# EAGLE design Square8 (EAGLE 6.4)
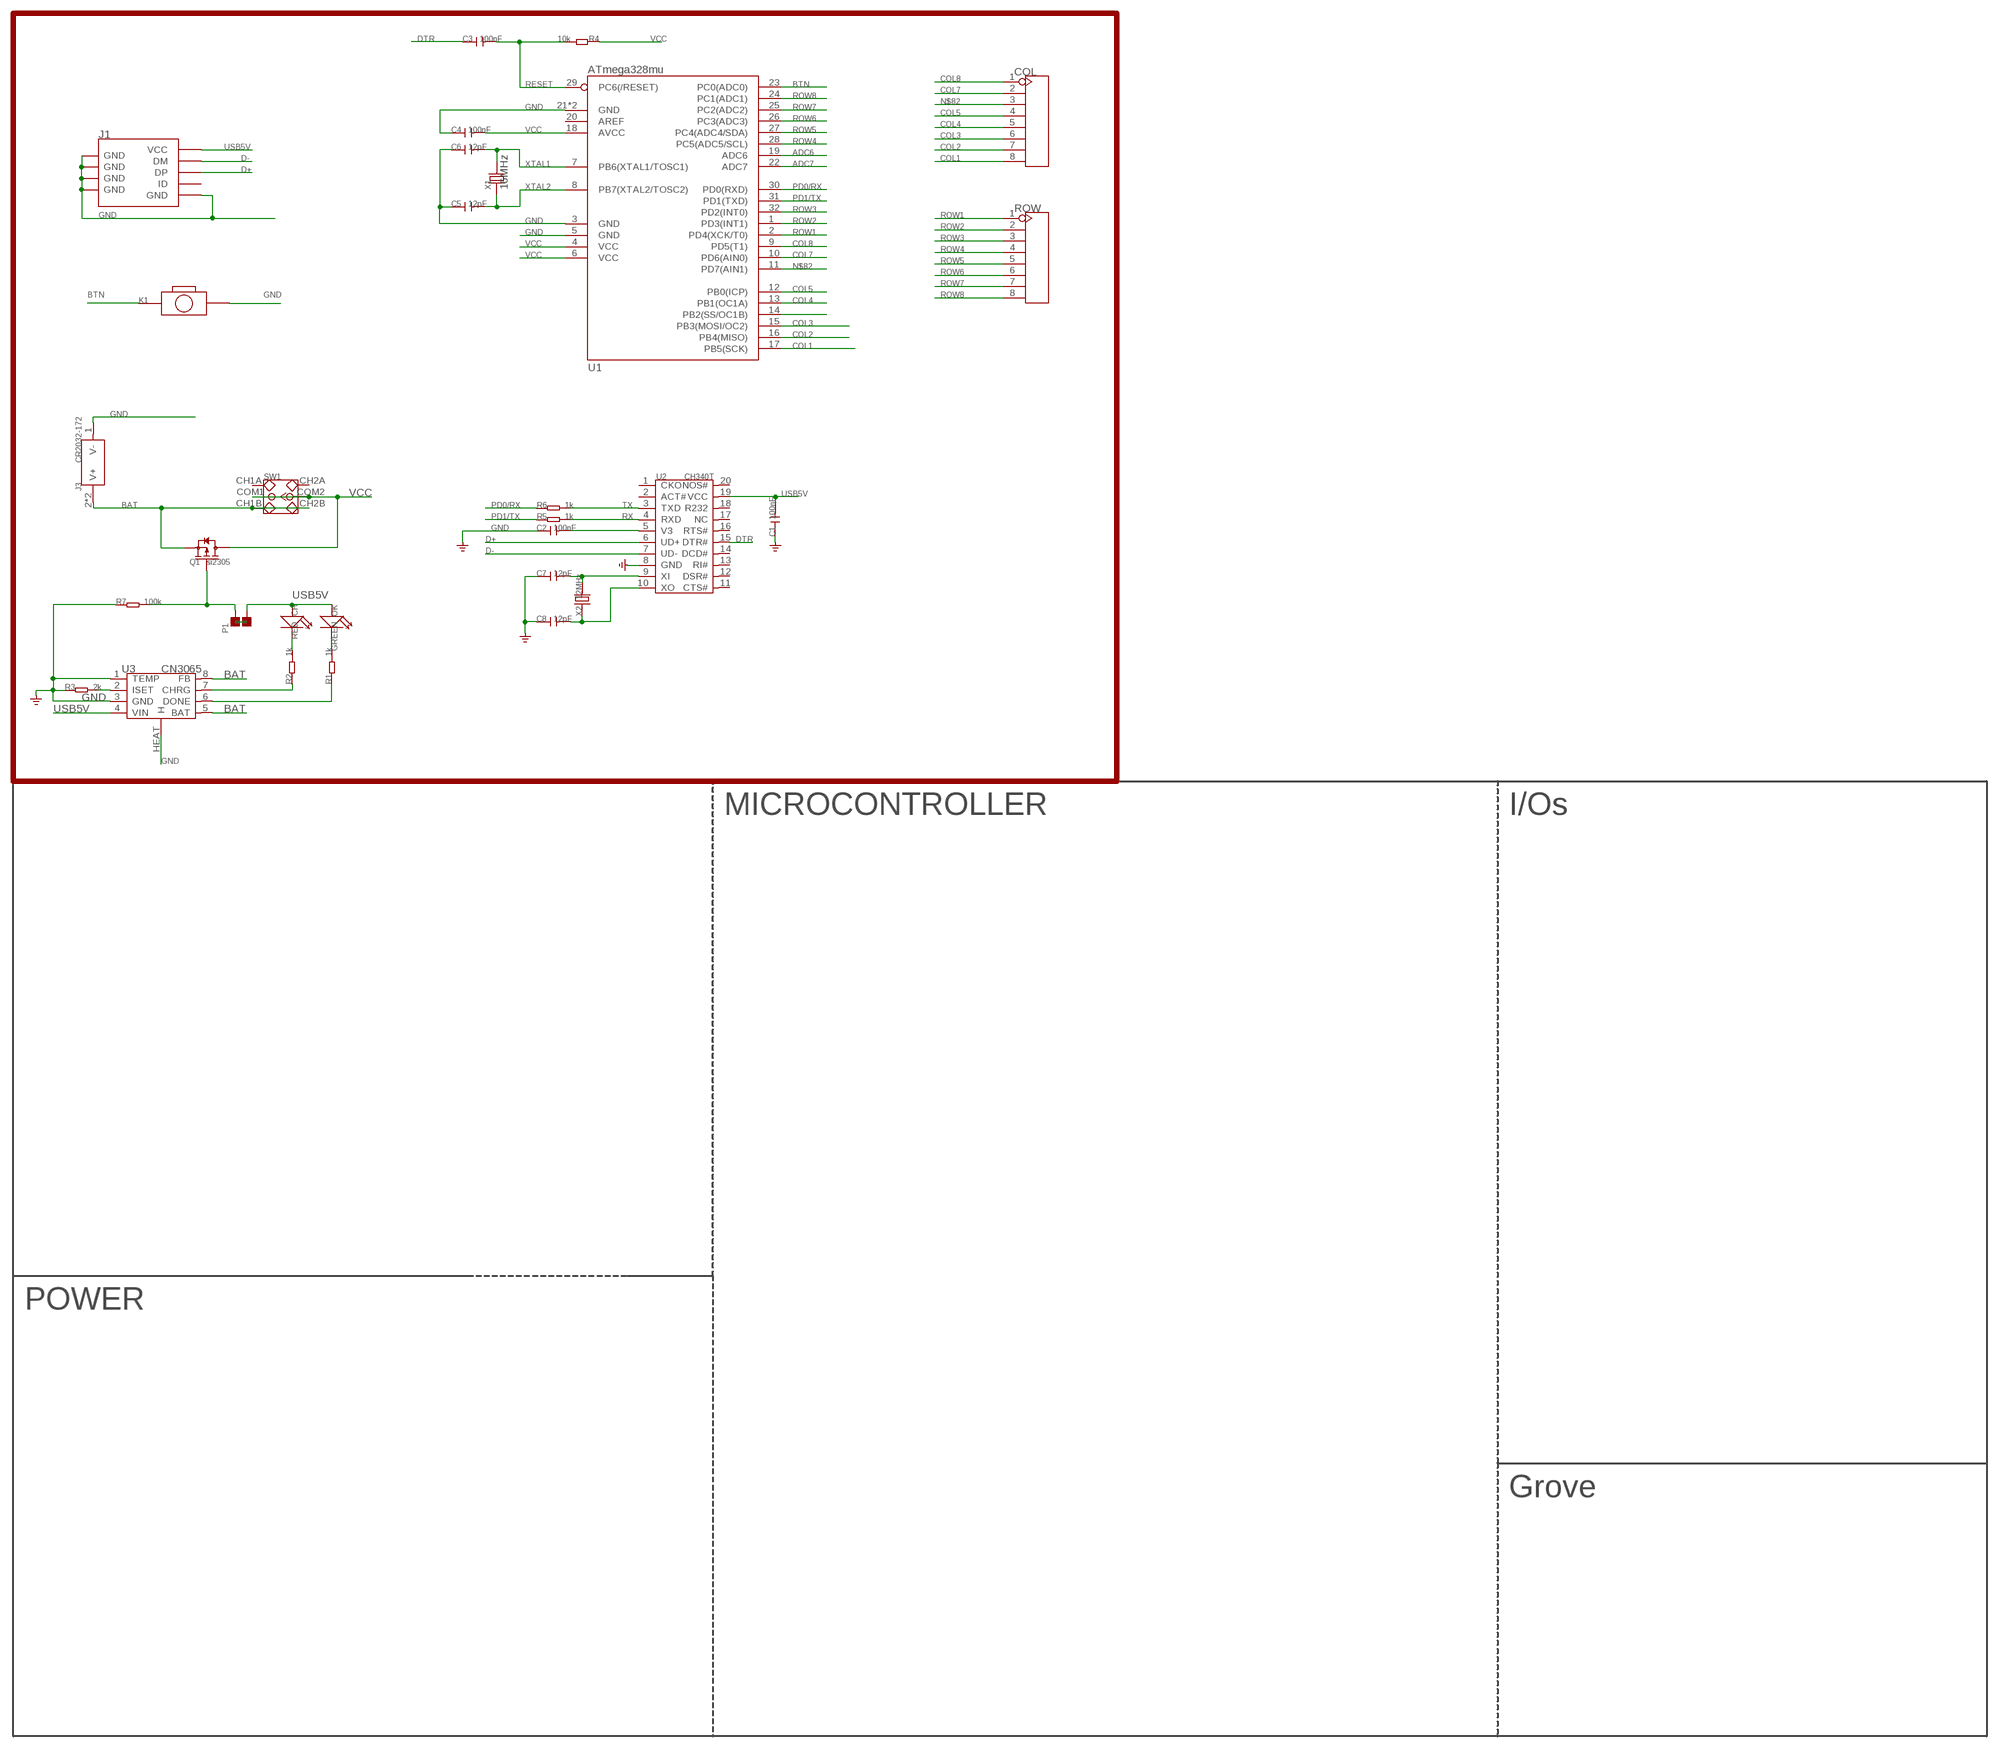
[diagram p0: schematic, sheet 1]

## Parts
C1  100nF  C'2.54'  [CERAMIC-2.54]
C2  100nF  C'2.54'  [CERAMIC-2.54]
C3  100nF  C'2.54'  [CERAMIC-2.54]
C4  100nF  C'2.54'  [CERAMIC-2.54]
C5  12pF  C-0603  [C0603]
C6  12pF  C-0603  [C0603]
C7  12pF  C-0603  [C0603]
C8  12pF  C-0603  [C0603]
CH  RED  LED-3MM  [LED-2P-2.54-3MM]
COL  HEADER-8P-2.54  [8P-2.54]
J1  USB-MINIUSB-5P-MICRO  [MICRO-USB]
J3  CR2032-172  HOLDER-BAT-CIRCLE  [2032-D20-CIRCLE]
K1  BUTTON-2P'TS-1101F'  [2P-3.4X6.0X3.55H-90D]
OK  GREEN  LED-3MM  [LED-2P-2.54-3MM]
P1  PAD-JUMPER-2P  [2P-SMD-1.78X1.27]
Q1  si2305  MOSFET-P'SI2323CDS/SI2305DS<BR>'  [SOT23]
R1  1k  R-0204/7  [R0204/7]
R2  1k  R-0204/7  [R0204/7]
R3  2k  R-0204/7  [R0204/7]
R4  10k  R-0204/7  [R0204/7]
R5  1k  R-0204/7  [R0204/7]
R6  1k  R-0204/7  [R0204/7]
R7  100k  R-0603  [R0603]
ROW  HEADER-8P-2.54  [8P-2.54]
SW1  SWITCH-2CH-6P'90D'  [6P-2CH-2.5-9.1X3.5X3.2H-90D]
U1  ATmega328mu  ATMEGA8/168/328MLF  [MLF32X-W/HEAT]
U2  CH340T  [SSOP20]
U3  CN3065  [DFN8]
X1  16MHz  CRYSTAL'HC49S'  [HC49S]
X2  12MHz  CRYSTAL'HC49S'  [HC49S]

## Nets
ADC6: U1.19(ADC6)
ADC7: U1.22(ADC7)
BAT: J3.2(V+) J3.3(V+) Q1.2(S) SW1.CH1B SW1.CH2B U3.5(BAT) U3.8(FB)
BTN: K1.P$1 U1.23(PC0(ADC0))
COL1: COL.8 U1.17(PB5(SCK))
COL2: COL.7 U1.16(PB4(MISO))
COL3: COL.6 U1.15(PB3(MOSI/OC2))
COL4: COL.5 U1.13(PB1(OC1A))
COL5: COL.4 U1.12(PB0(ICP))
COL7: COL.2 U1.10(PD6(AIN0))
COL8: COL.1 U1.9(PD5(T1))
D+: J1.3(DP) U2.6(UD+)
D-: J1.2(DM) U2.7(UD-)
DTR: C3.1 U2.15(DTR#)
GND [none1]: C1.1 C2.1 C4.1 C5.1 C6.1 C7.1 C8.1 J1.5(GND) J1.S1(GND) J1.S2(GND) J1.S3(GND) J1.S4(GND) J1.S5(GND) J1.S6(GND) J3.1(V-) K1.P$2 R3.1 R7.1 U1.3(GND) U1.5(GND) U1.21(GND) U1.HEAT(GND) U2.8(GND) U3.1(TEMP) U3.3(GND) U3.HEAT(H)
N$1: U1.14(PB2(SS/OC1B))
N$2: R2.1 U3.7(CHRG)
N$3: R1.1 U3.6(DONE)
N$4: OK.K(-) R1.2
N$5: CH.K(-) R2.2
N$7: R3.2 U3.2(ISET)
N$39: C7.2 U2.9(XI) X2.2
N$40: C8.2 U2.10(XO) X2.1
N$82: COL.3 U1.11(PD7(AIN1))
N$86: P1.2 Q1.1(G) R7.2
PD0/RX: R6.1 U1.30(PD0(RXD))
PD1/TX: R5.1 U1.31(PD1(TXD))
RESET: C3.2 R4.2 U1.29(PC6(/RESET))
ROW1: ROW.1 U1.2(PD4(XCK/T0))
ROW2: ROW.2 U1.1(PD3(INT1))
ROW3: ROW.3 U1.32(PD2(INT0))
ROW4: ROW.4 U1.28(PC5(ADC5/SCL))
ROW5: ROW.5 U1.27(PC4(ADC4/SDA))
ROW6: ROW.6 U1.26(PC3(ADC3))
ROW7: ROW.7 U1.25(PC2(ADC2))
ROW8: ROW.8 U1.24(PC1(ADC1))
RX: R5.2 U2.4(RXD)
TX: R6.2 U2.3(TXD)
USB5V: C1.2 CH.A(+) J1.1(VCC) OK.A(+) P1.1 U2.19(VCC) U3.4(VIN)
V3: C2.2 U2.5(V3)
VCC: C4.2 Q1.3(D) R4.1 SW1.COM1 SW1.COM2 U1.4(VCC) U1.6(VCC) U1.18(AVCC)
XTAL1: C6.2 U1.7(PB6(XTAL1/TOSC1)) X1.2
XTAL2: C5.2 U1.8(PB7(XTAL2/TOSC2)) X1.1
Unconnected: J1.4(ID) SW1.CH1A SW1.CH2A U1.20(AREF) U2.1(CKO) U2.2(ACT#) U2.11(CTS#) U2.12(DSR#) U2.13(RI#) U2.14(DCD#) U2.16(RTS#) U2.17(NC) U2.18(R232) U2.20(NOS#)

## Notes on the sheet
- MICROCONTROLLER | I/Os
- POWER
- Grove

## Library data of the parts
C1-C8 = Discrete:C*: Ceramic Capacitors
CH OK = Discrete:LED*
COL ROW = Connector :HEADER-8P
J1 = dwin:USB-MINIUSB-5P
J3 = dwin:HOLDER-BAT: button cell holder
K1 = Discrete:BUTTON-2P
P1 = Discrete:PAD-JUMPER-2P; PARTNO: DNP
Q1 = Discrete:MOSFET-P
R1-R7 = Discrete:R*
SW1 = Discrete:SWITCH-2CH-6P
U1 = IC:ATMEGA8/168/328: MICROCONTROLLER
U2 = template:CH340T
U3 = IC:CN3065
X1 X2 = Discrete:CRYSTAL*: CRYSTAL

## Net classes
0 default: width 0.152 mm, drill 0.305 mm, clearance 0.152 mm
3 usbvcc: width 0.203 mm, drill 0.305 mm, clearance 0.203 mm

## Board
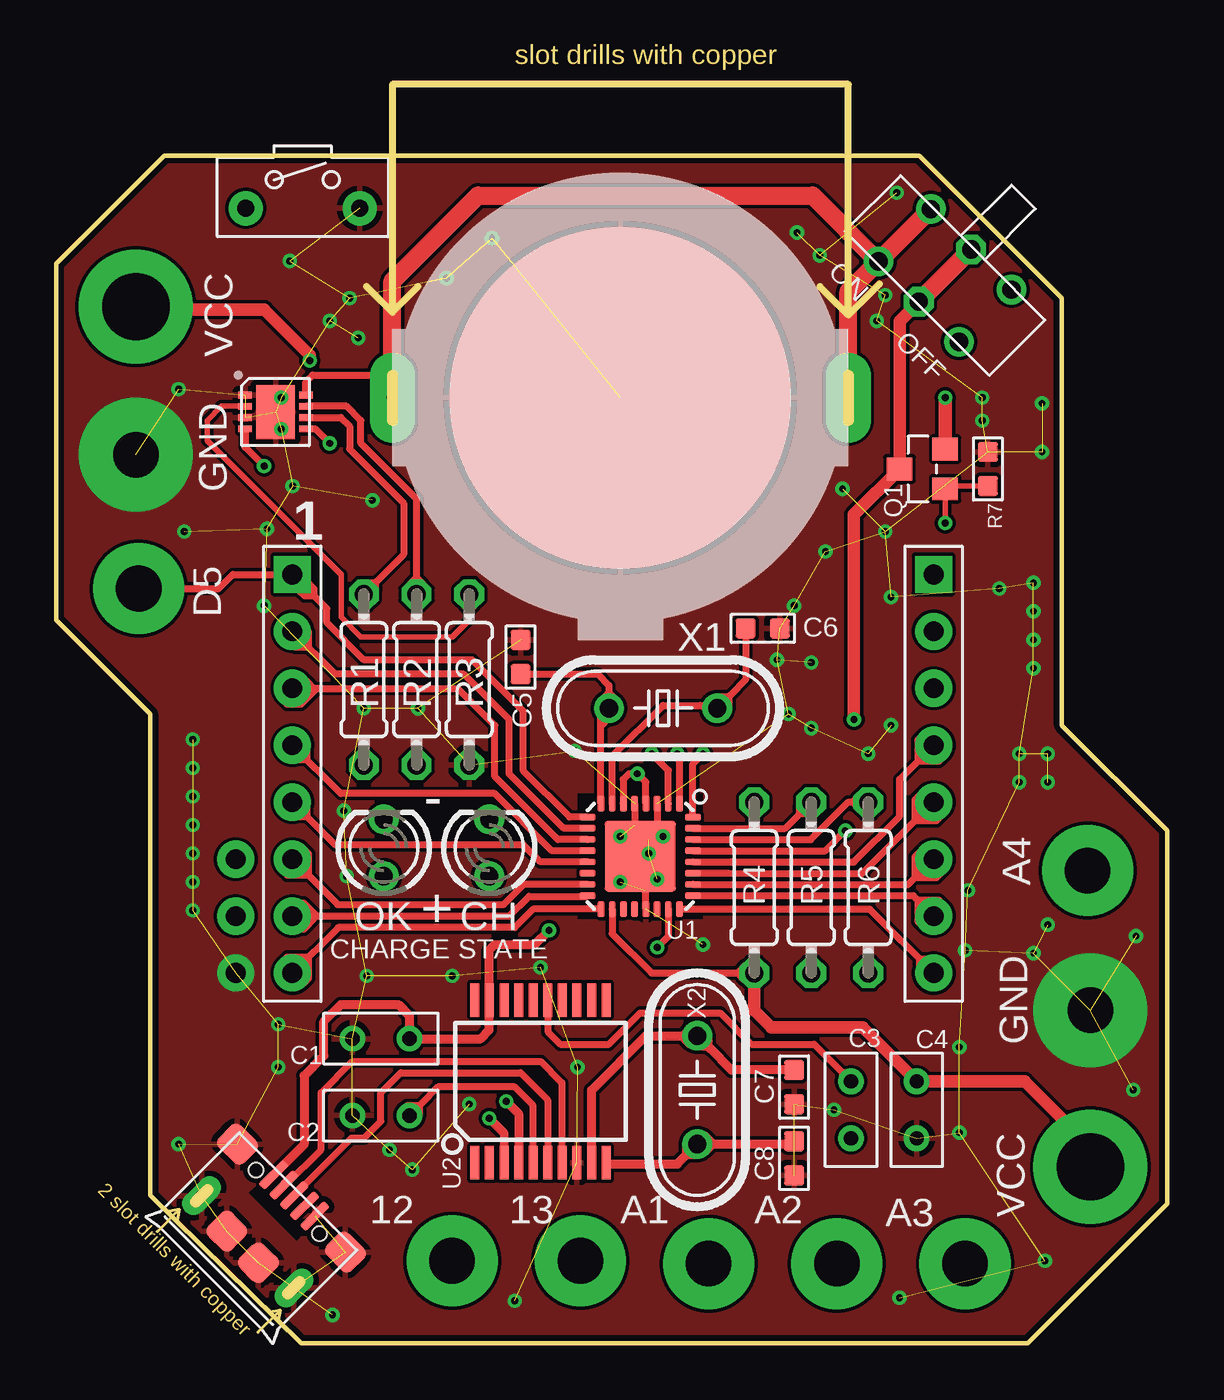
[diagram p1: board, top side]
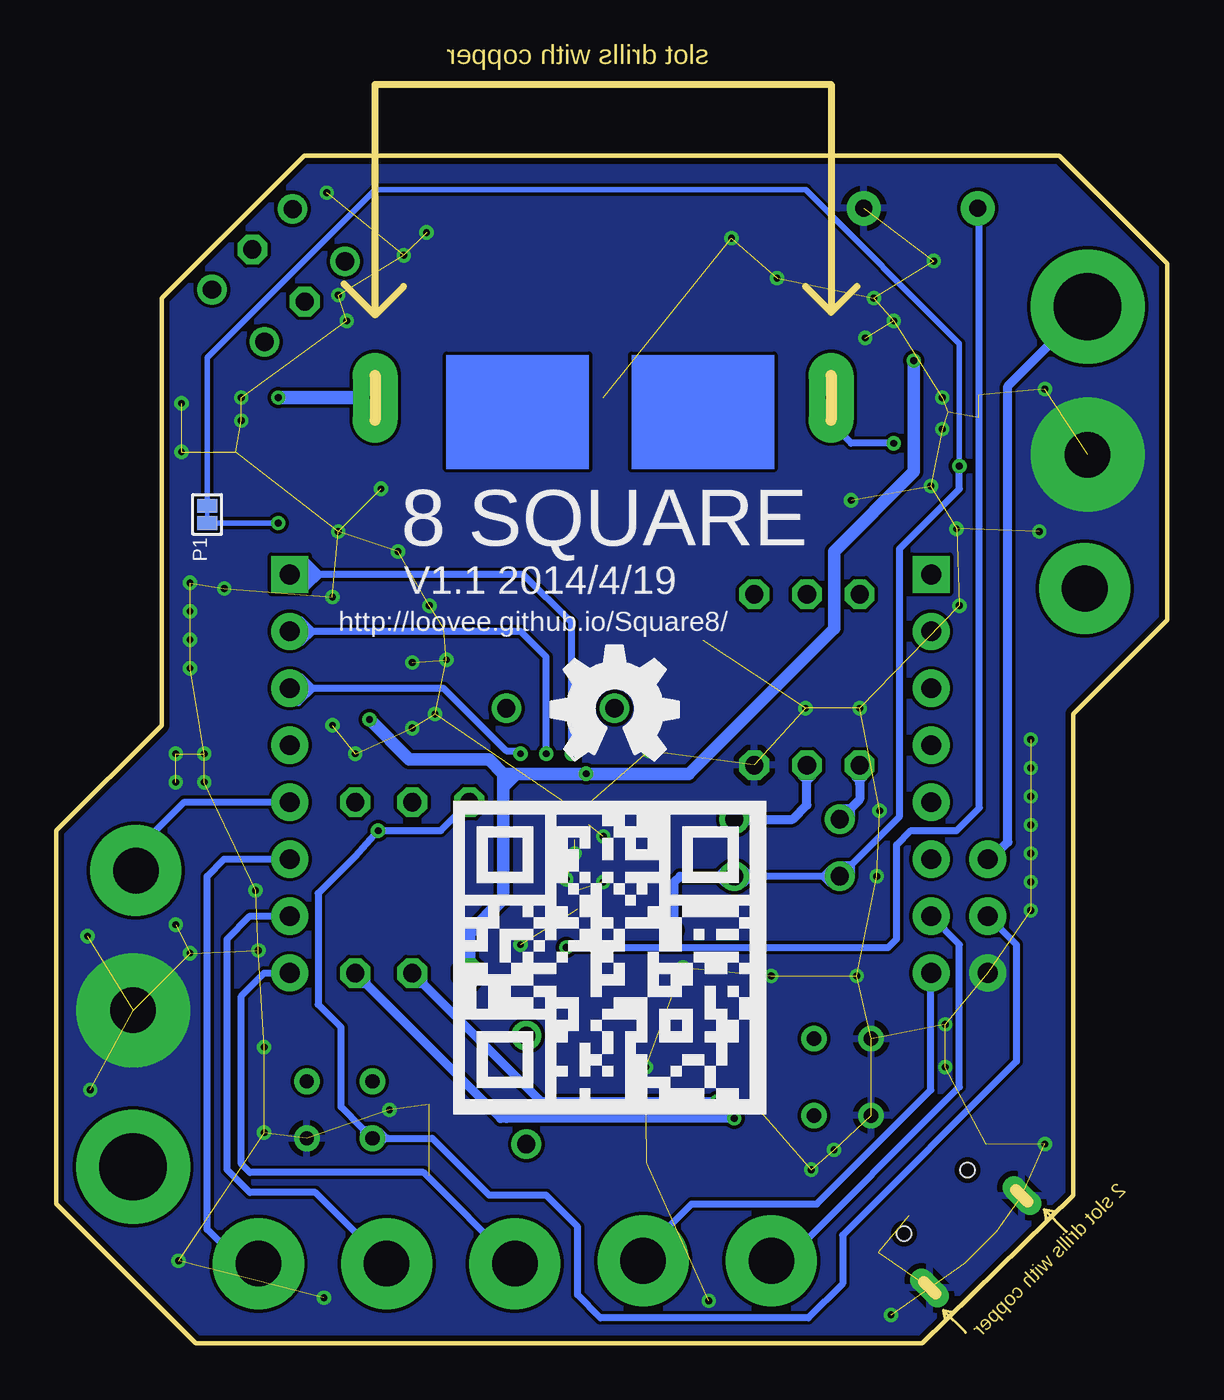
[diagram p2: board, bottom side, seen from below]

Size 49.53 x 52.96 mm. Coordinates in mm from the lower left corner, seen from the top.
Outline: 38.48,52.96 4.83,52.96 0,48.13 0,32.26 4.19,28.07 4.19,6.6 10.92,0 43.31,0 49.53,6.22 49.53,22.86 44.83,27.56 44.83,46.61 38.48,52.96
Copper layers (1*16): Top 0.035mm / dielectric 1.5mm / Bottom 0.035mm
Design rules "SeeedStudio_DRU_no_angle_20130527": minimum track width 6mil, minimum drill 12mil, track to track 6mil, track to pad 6mil, pad to pad 6mil, via to via 6mil, smd to smd 0mil, copper to edge 10mil, drill to drill 10mil, minimum pad ring 10mil, minimum via ring 6mil, stop-mask expansion 2mil, vias tented up to drill 25mil, thermal gap 10mil

### Footprints (pad centres in the part's own frame; a part is rotated, then mirrored left to right if it is on the bottom)
CERAMIC-2.54 = drill 0.635 pad 1.143: 1 -1.27,0; 2 1.27,0
C0603 = smd 0.889 x 0.889: 1 -0.762,0; 2 0.762,0
LED-2P-2.54-3MM = drill 0.813: A -1.27,0; K 1.27,0
8P-2.54 = drill 0.889 pad 1.651 square: 1 0,8.89 | drill 0.889 pad 1.651: 2 0,6.35; 3 0,3.81; 4 0,1.27; 5 0,-1.27; 6 0,-3.81; 7 0,-6.35; 8 0,-8.89
MICRO-USB = smd 0.381 x 1.524: 1 -1.3,-0.25; 2 -0.65,-0.25; 3 0,-0.25; 4 0.65,-0.25; 5 1.3,-0.25 | smd 1.6 x 1.397: S1 -3.4,-0.427; S6 3.4,-0.427 | drill 0.508 pad 1.016 long: S2 -2.908,-3.175; S5 2.908,-3.175 | smd 1.5 x 1.5: S3 -1,-3.5; S4 1,-3.5 | hole 0.635: -2,-0.65; 2,-0.65
2032-D20-CIRCLE = smd 15.24 x 15.24: 1 0,0 | drill 0.5 pad 2 long: 2 -10.16,0; 3 10.16,0
2P-3.4X6.0X3.55H-90D = drill 0.762 pad 1.524: P$1 0,2.54; P$2 0,-2.54
2P-SMD-1.78X1.27 = smd 0.889 x 0.61: 1 0,0.381; 2 0,-0.381
SOT23 = smd 1.016 x 1.143: 1 -0.889,-1.016; 2 0.889,-1.016; 3 0,1.016
R0204/7 = drill 0.813 octagon: 1 -3.81,0; 2 3.81,0
R0603 = smd 0.889 x 0.889: 1 -0.762,0; 2 0.762,0
6P-2CH-2.5-9.1X3.5X3.2H-90D = drill 0.813 pad 1.27: CH1A -2.54,-1.65; CH1B 2.54,-1.65; CH2A -2.54,1.65; CH2B 2.54,1.65 | drill 0.813 pad 1.27 octagon: COM1 0,-1.65; COM2 0,1.65
MLF32X-W/HEAT = smd 0.7 x 0.3: 1 -2.35,1.75; 2 -2.35,1.25; 3 -2.35,0.75; 4 -2.35,0.25; 5 -2.35,-0.25; 6 -2.35,-0.75; 7 -2.35,-1.25; 8 -2.35,-1.75; 17 2.35,-1.75; 18 2.35,-1.25; 19 2.35,-0.75; 20 2.35,-0.25; 21 2.35,0.25; 22 2.35,0.75; 23 2.35,1.25; 24 2.35,1.75 | smd 0.3 x 0.7: 9 -1.75,-2.35; 10 -1.25,-2.35; 11 -0.75,-2.35; 12 -0.25,-2.35; 13 0.25,-2.35; 14 0.75,-2.35; 15 1.25,-2.35; 16 1.75,-2.35; 25 1.75,2.35; 26 1.25,2.35; 27 0.75,2.35; 28 0.25,2.35; 29 -0.25,2.35; 30 -0.75,2.35; 31 -1.25,2.35; 32 -1.75,2.35 | smd 3.175 x 3.175: HEAT 0,0
SSOP20 = smd 0.4 x 1.5: 1 -2.925,-3.625; 2 -2.275,-3.625; 3 -1.625,-3.625; 4 -0.975,-3.625; 5 -0.325,-3.625; 6 0.325,-3.625; 7 0.975,-3.625; 8 1.625,-3.625; 9 2.275,-3.625; 10 2.925,-3.625; 11 2.925,3.625; 12 2.275,3.625; 13 1.625,3.625; 14 0.975,3.625; 15 0.325,3.625; 16 -0.325,3.625; 17 -0.975,3.625; 18 -1.625,3.625; 19 -2.275,3.625; 20 -2.925,3.625
DFN8 = smd 0.3 x 0.6: 1 -0.75,-1.35; 2 -0.25,-1.35; 3 0.25,-1.35; 4 0.75,-1.35; 5 0.75,1.35; 6 0.25,1.35; 7 -0.25,1.35; 8 -0.75,1.35 | smd 2.4 x 1.7: HEAT 0,0
HC49S = drill 0.813: 1 -2.413,0; 2 2.413,0

### Placement (x,y rotation side)
C1  14.48,13.59 0 top
C2  14.48,10.16 0 top
C3  35.43,10.41 270 top
C4  38.35,10.41 90 top
C5  20.7,30.61 270 top
C6  31.5,31.88 180 top
C7  32.89,11.43 90 top
C8  32.89,8.25 90 top
CH  19.3,22.1 90 top
COL  10.53,25.4 0 top
J1  10.79,6.78 315 top
J3  25.15,42.16 180 top
K1  10.99,50.61 90 top
OK  14.6,22.1 90 top
P1  42.8,36.96 0 bottom
Q1  38.61,38.99 90 top
R1  13.72,29.59 270 top
R2  16.07,29.59 270 top
R3  18.42,29.59 90 top
R4  31.11,20.32 90 top
R5  33.66,20.32 270 top
R6  36.2,20.32 270 top
R7  41.53,38.99 270 top
ROW  39.11,25.4 0 top
SW1  39.61,47.61 135 top
U1  26.04,21.72 270 top
U2  21.59,11.68 0 top
U3  9.78,41.53 270 top
U$1  [OSHW_FILLX200_NOTEXT]  27.47,26.02 0 bottom
X1  27.05,28.32 0 top
X2  28.57,11.3 90 top

### Tracks (layer width: path | path; a pad name or v marks a point on that pad's centre or on a via)
BAT  (via drill 0.3 pad 0.64)
  Top 0.305: U3.8 11.13,42.88 11.43,43.18 14.48,43.18 14.99,42.67 | U3.5 11.54,40.78 v12.19,40.13
  Top 0.406: 14.87,42.28 J3.3
  Top 0.61: Q1.2 v39.62,42.16
  Top 0.813: SW1.CH2B SW1.CH1B | J3.2 35.31,46.89 SW1.CH2B | J3.3 14.99,42.67 14.99,47.37 18.8,51.18 33.71,51.18 SW1.CH2B
  Bottom 0.305: v12.19,40.13 14.1,40.13 14.73,40.77 14.73,41.91 J3.3
  Bottom 0.61: v39.62,42.16 J3.2
BTN  (via drill 0.3 pad 0.64)
  Top 0.305: U1.23 27.29,18.14 v26.8,17.65
  Bottom 0.305: v26.8,17.65 12.45,17.65 12.06,18.03 12.06,22.22 11.43,22.86 9.4,22.86 8.38,23.88 8.38,50.54 K1.P$1
COL1  (via drill 2.03 pad 4.06)
  Top 0.305: U1.17 21.27,19.37 20.45,18.54 12.57,18.54 12.57,18.53 10.55,16.51 COL.8
  Bottom 0.305: v23.37,3.68 23.37,4.06 21.21,6.22 15.62,6.22 10.54,11.3 COL.8
COL2  (via drill 2.03 pad 4.06)
  Top 0.203: 23.66,19.94 U1.16 | 11.68,19.05 11.05,19.68 10.54,19.68
  Top 0.305: 23.66,19.94 21.08,19.94 20.19,19.05 11.68,19.05 11.43,19.05 | COL.7 11.43,19.05 | 11.18,19.3 11.43,19.05 | 11.43,19.05 11.05,18.67
  Bottom 0.305: v17.65,3.68 17.02,3.68 9.27,11.43 9.27,17.79 COL.7
COL3
  Top 0.305: U1.15 20.85,20.47 19.94,19.56 12.57,19.56 12.57,19.57 12.55,19.57 COL.6
COL4
  Top 0.305: U1.13 21.59,21.47 20.83,22.22 12.44,22.22 12.44,22.24 12.42,22.24 COL.5
COL5
  Top 0.305: U1.12 22.1,21.97 19.56,24.51 12.69,24.51 12.69,24.52 12.68,24.52 COL.4
COL7
  Top 0.305: U1.10 22.63,22.97 20.19,25.4 20.19,27.81 18.16,29.84 12.44,29.84 12.44,29.86 12.42,29.86 COL.2
COL8  (via drill 2.03 pad 4.06)
  Top 0.305: U1.9 22.89,23.47 20.83,25.53 20.83,28.19 18.54,30.48 13.72,30.48 12.06,32.13 12.06,32.76 COL.1 7.87,34.29 7.24,33.66 v3.68,33.66
D+
  Top 0.203: 21.97,8.11 U2.6
  Top 0.305: J1.3 13.15,9.14 13.72,9.14 14.48,9.91 14.48,11.18 15.37,12.07 20.7,12.07 21.91,10.86 U2.6
D-
  Top 0.203: 22.48,8.14 U2.7 | J1.2 10.23,7.06
  Top 0.305: 10.23,7.06 11.81,8.64 11.81,11.18 13.21,12.57 21.59,12.57 22.54,11.62 22.54,8.08 U2.7
DTR
  Top 0.305: U2.15 21.92,13.9 22.48,13.33 24.64,13.33 26.04,14.73 29.59,14.73 30.99,13.33 33.78,13.33 C3.1
GND  (via drill 0.3 pad 0.64, 0.89 pad 1.65, 2.03 pad 5.08)  (108 unrouted)
  Top 0.305: v26.42,21.84 26.16,21.84 U1.HEAT | U1.21 26.29,20.19 v26.8,20.7 | U1.3 26.79,22.87 v27.05,22.61 26.92,22.48 26.42,22.48 25.79,23.11 U1.5
  other vias: 46.1,14.86 3.56,39.62 37.21,33.27 37.21,27.56 10.03,42.16 10.03,40.77 8,16.51 42.93,26.29 25.15,22.61 25.15,20.57 23.11,26.42 13.72,28.32 16.13,28.32 42.93,25.02 44.2,25.02 44.2,26.29 43.94,41.91 43.94,39.75 42.04,33.66 41.27,42.16 28.83,17.78 12.83,23.75 37.46,51.31 6.1,26.92 6.1,25.65 6.1,24.38 6.1,23.11 6.1,21.84 6.1,20.57 6.1,19.3 32.13,30.48 33.66,30.35 32.89,32.89 32.64,28.07 33.66,27.43 21.59,16.76 23.24,12.32 14.86,8.64 18.42,10.67 40.64,20.19 44.2,18.67 40.51,17.53 43.56,17.4 13.46,44.83 13.08,46.61 12.19,45.59 10.41,48.26 10.54,38.23 37.59,2.03 20.45,1.9 12.32,1.27 5.46,8.89 13.84,16.38 17.65,16.38 36.2,26.29 9.27,32.89 44.07,3.68 48.01,11.3 48.13,18.16 43.56,33.91 43.56,32.64 43.56,31.37 43.56,30.1 35.05,38.1 34.29,35.31 15.87,7.75 9.91,14.22 9.91,12.32 12.95,20.83 36.96,36.19 41.27,41.15 36.58,45.59 36.96,46.74 33.02,49.53 34.04,48.51 19.43,49.28 17.4,47.5 14.1,37.59 9.4,36.32 5.46,42.55 5.71,36.19 40.26,13.21 40.26,9.4 34.67,10.41
  pour Top: -5.21,56.52 54.86,56.9 55.12,-4.19 -4.57,-2.79
  pour Bottom: -5.21,56.52 -4.57,-2.79 55.24,-4.06 54.74,56.9
N$2
  Top 0.305: R2.1 16.07,37.66 13.59,40.13 13.59,41.15 12.95,41.78 U3.7
N$3
  Top 0.203: 13.78,33.97 14.29,33.97 14.29,33.59
  Top 0.305: U3.6 12.7,41.28 13.08,40.89 13.08,39.88 15.49,37.47 15.49,35.18 14.29,33.97 R1.1
N$4
  Bottom 0.203: 13.97,25.34 13.97,25.21 13.72,24.96 13.46,25.21 13.46,25.34 | 14.03,23.43 14.03,23.94 14.54,23.94
  Bottom 0.406: R1.2 13.72,24.96 13.72,24.26 14.03,23.94 OK.K
N$5
  Bottom 0.203: 18.42,23.37 18.54,23.37 18.92,22.99
  Bottom 0.406: CH.K 18.42,23.37 16.7,23.37 16.07,24 R2.2
N$6
  Top 0.203: 10.54,31.11 10.67,30.99 11.3,30.99 11.3,31.75 11.05,32
N$7
  Top 0.203: 18.67,32.89 18.67,32.83 18.42,32.58 18.16,32.83 18.16,32.96
  Top 0.254: R3.2 18.42,32.58 18.42,32.26 17.65,31.5 13.59,31.5 12.7,32.39 12.7,34.29 6.73,40.26 6.73,41.15 7.37,41.78 U3.2
N$8
  Top 0.203: 11.24,26.61 11.24,25.91
N$11
  Top 0.203: 10.92,33.53 11.05,33.53 11.3,33.27 | 11.3,33.91 11.3,33.78 11.56,33.53 | 11.56,33.53 11.56,33.27 11.3,33.27 | 11.56,33.53 11.56,33.66 11.05,34.16 | 11.3,33.27 11.05,33.27 10.79,33.53
N$12
  Top 0.305: 10.67,26.04 11.18,26.04
N$38
  Top 0.305: 11.18,24 11.18,23.5 10.67,23.5
N$39
  Top 0.203: 28.51,13.14 29.15,13.14
  Top 0.406: C7.2 30.1,12.19 29.15,13.14 X2.2 26.29,13.72 23.87,11.29 U2.9
N$40
  Top 0.203: 24.57,8 U2.10 | 28.96,9.33 29.4,8.89 29.02,8.51
  Top 0.406: 24.57,8 27.69,8 X2.1 29.4,8.89 32.77,8.89 C8.2
N$67
  Top 0.305: 11.18,21.46 11.18,20.96 10.67,20.96
N$68
  Top 0.305: 11.18,16.64 11.18,17.14 10.54,17.14
N$70
  Top 0.305: 38.48,26.67 38.48,26.04 38.99,26.04
N$71
  Top 0.305: 38.48,24.13 38.48,23.5 39.12,23.5
N$72
  Top 0.305: 38.48,21.46 38.48,20.96 38.99,20.96
N$73
  Top 0.305: 38.48,19.3 38.48,19.68 38.99,19.68
N$74
  Top 0.305: 38.86,17.14 38.48,17.14 38.48,16.51
N$75
  Top 0.203: 38.35,26.04 38.35,26.92 38.61,27.18
N$76
  Top 0.203: 38.35,25.91 39.37,25.91 39.5,26.04
N$77
  Top 0.203: 38.73,24.76 38.23,24.26 38.23,23.24 39.24,23.24 39.62,23.62
N$78
  Top 0.203: 38.23,20.83 38.23,21.72 38.61,22.1
N$79
  Top 0.203: 38.23,20.7 39.24,20.7 39.62,21.08
N$80
  Top 0.203: 38.35,19.81 38.35,18.8 38.61,18.54
N$81
  Top 0.203: 38.48,19.81 39.37,19.81 39.62,19.56
N$82
  Top 0.203: 11.68,29.21 10.92,28.45 10.29,28.45 10.03,28.7 | 11.18,28.83 11.56,29.21 11.18,29.59
  Top 0.305: U1.11 22.36,22.47 19.56,25.27 19.56,27.56 17.91,29.21 11.68,29.21 11.56,29.21 COL.3
N$83
  Top 0.203: 10.92,22.22 11.3,21.84 11.3,20.83 10.29,20.83 10.16,20.96
N$84
  Top 0.203: 11.56,18.92 11.05,18.41 10.54,18.41
N$85
  Top 0.203: 10.03,17.02 10.29,17.27 11.3,17.27 11.3,16.26 11.05,16
N$86  (via drill 0.3 pad 0.64)
  Top 0.254: R7.2 39.75,38.23 Q1.1 v39.62,36.58
  Bottom 0.254: P1.2 v39.62,36.58
N$87
  Bottom 0.203: 42.8,36.7 42.8,37.21
N$88
  Top 0.203: 33.08,23.62 33.08,23.94
N$89
  Top 0.203: 33.15,23.56 33.59,23.56
N$90
  Bottom 0.203: 31.69,23.5 31.69,23.94 31.62,24
N$91
  Bottom 0.203: 31.75,23.56 31.31,23.56
N$92
  Bottom 0.203: 35.62,16.45 35.62,16
N$93
  Bottom 0.203: 36.26,15.94 35.69,15.94
N$94
  Bottom 0.203: 33.08,16.38 33.08,16
N$95
  Bottom 0.203: 33.59,15.94 33.15,15.94
N$96
  Bottom 0.203: 34.8,9.21 35.11,9.52
N$97
  Bottom 0.203: 35.88,9.21 35.88,9.65
N$98
  Top 0.203: 28,8.95 28,8.38
N$99
  Top 0.203: 28.57,8.32 28.07,8.32
N$100
  Top 0.203: 27.69,13.78 27.88,13.78 28.26,14.16
N$101
  Top 0.203: 28.26,13.27 28.19,13.27 27.81,13.65
N$102
  Top 0.203: 29.15,13.72 29.15,13.08
N$103
  Top 0.203: 30.67,16.89 30.35,16.57
N$104
  Top 0.203: 30.67,16.19 30.61,16.19 30.35,16.45
N$105
  Top 0.203: 15.75,33.84 15.75,33.91 16,34.16
N$106
  Top 0.203: 16.38,33.91 16.13,34.16
N$107
  Bottom 0.203: 14.99,21.21 15.05,21.21 15.37,20.89
N$108
  Bottom 0.203: 15.05,20.45 15.37,20.76
N$109
  Bottom 0.203: 14.03,20.83 14.03,21.34
N$110
  Bottom 0.203: 20.32,20.76 20.07,20.76 19.75,20.45
N$111
  Bottom 0.203: 16.38,25.4 16.38,25.27 16,24.89
N$112
  Bottom 0.203: 15.75,25.4 15.75,25.27 16,25.02
N$113
  Bottom 0.203: 18.42,23.5 18.67,23.5 18.92,23.75
N$114
  Top 0.203: 24.38,27.56 24.64,27.81
N$115
  Top 0.203: 34.99,11.75 34.99,12.19
N$116
  Top 0.203: 34.92,12.13 35.43,12.13
PD0/RX
  Top 0.203: 35.81,24.51 35.43,24.13 35.69,23.88
  Top 0.305: U1.30 33.64,22.47 35.31,24.13 35.43,24.13 R6.1
PD1/TX
  Top 0.305: U1.31 32.49,22.97 R5.1
RESET  (via drill 0.3 pad 0.64, 0.89 pad 1.65)
  Top 0.305: U1.29 34.29,21.97 v35.18,22.86
  Bottom 0.203: 34.73,9.14 34.8,9.14 35.11,8.83 | 35.43,9.59 35.88,9.59
  Bottom 0.305: v8,19.05 6.73,17.78 6.73,12.57 14.48,4.83 14.48,2.67 16,1.14 25.27,1.14 26.29,2.16 26.29,5.21 27.69,6.6 30.23,6.6 32.77,9.14 34.73,9.14 C3.2 35.88,9.59 36.83,10.54 36.83,14.1 37.85,15.11 37.85,20.07 36.2,21.72 v35.18,22.86 32.38,22.86 R4.2
ROW1  (via drill 0.3 pad 0.64)
  Top 0.305: U1.2 27.29,25.55 v26.54,26.29
  Bottom 0.203: 38.35,34.92 37.72,34.29 38.35,33.66
  Bottom 0.305: 37.97,34.29 37.72,34.29 28.7,34.29 26.54,32.13 v26.54,26.29 | 37.97,34.29 ROW.1 | 37.97,34.29 38.48,34.8 | 37.97,34.29 38.48,33.78
ROW2  (via drill 0.3 pad 0.64)
  Top 0.305: U1.1 27.79,26.19 v27.69,26.29
  Bottom 0.305: 38.1,31.75 28.83,31.75 27.69,30.61 v27.69,26.29 | 38.1,31.75 ROW.2 | 38.1,31.75 38.61,32.26 | 38.1,31.75 38.61,31.24
ROW3  (via drill 0.3 pad 0.64)
  Top 0.305: U1.32 28.39,25.84 v28.83,26.29
  Bottom 0.305: 38.1,29.21 32.26,29.21 29.46,26.42 28.96,26.42 v28.83,26.29 | 38.1,29.21 ROW.3 | 38.1,29.21 38.61,29.72 | 38.1,29.21 38.73,28.57
ROW4
  Top 0.305: U1.28 30.1,21.47 31.11,21.46 35.56,21.46 37.59,23.5 37.59,25.15 ROW.4
ROW5  (via drill 2.03 pad 4.06)
  Top 0.305: U1.27 29.96,20.97 30.99,20.96 35.95,20.96 35.95,20.97 ROW.5
  Bottom 0.305: v45.97,21.08 45.97,21.97 43.81,24.13 ROW.5
ROW6  (via drill 2.03 pad 4.06)
  Top 0.305: U1.26 38,20.47 38,20.48 ROW.6
  Bottom 0.305: v40.51,3.56 41.27,3.56 42.8,5.08 42.8,20.83 42.04,21.59 ROW.6
ROW7  (via drill 2.03 pad 4.06)
  Top 0.305: U1.25 38.21,19.97 38.21,19.95 ROW.7
  Bottom 0.305: ROW.7 40.89,19.05 41.91,18.03 41.91,7.75 40.89,6.73 37.97,6.73 v34.8,3.56
ROW8  (via drill 2.03 pad 4.06)
  Top 0.305: U1.24 36.27,19.37 36.27,19.35 ROW.8
  Bottom 0.305: v29.08,3.56 33.15,7.62 40.89,7.62 41.27,8 41.27,15.49 40.26,16.51 ROW.8
RX  (via drill 0.3 pad 0.64)
  Top 0.406: v20.07,10.79 20.62,10.25 U2.4
  Bottom 0.381: 28.07,10.92 R5.2
  Bottom 0.406: 28.07,10.92 27.94,10.79 v20.07,10.79
TX  (via drill 0.3 pad 0.64)
  Top 0.381: U2.3 19.96,9.37 v19.3,10.03
  Bottom 0.406: v19.3,10.03 29.46,10.03 29.72,10.03 R6.2
USB5V  (via drill 0.3 pad 0.64)
  Top 0.203: U2.19
  Top 0.305: U3.4 8.43,39.96 v9.27,39.12
  Top 0.406: U2.19 19.3,13.97 18.92,13.59 C1.2 15.75,14.61 15.24,15.11 12.7,15.11 11.94,14.35 11.94,12.83 11.05,11.94 11.05,8.88 J1.1 | U2.19 19.32,17.54 19.56,17.78 21.34,17.78 v21.97,18.41
  Bottom 0.203: 14.54,21.4 14.03,21.4 | 18.86,21.21 18.48,20.83 18.86,20.45 18.92,20.45 | 20.13,20.83 19.75,21.21
  Bottom 0.254: P1.1 42.8,43.94 35.31,51.44 16.13,51.44 9.27,44.58 v9.27,39.12
  Bottom 0.305: v9.27,39.12 9.27,38.1 11.94,35.43 11.94,23.5 14.03,21.4 OK.A 18.48,20.83 CH.A
  Bottom 0.406: v21.97,18.41 21.97,20.57 21.72,20.83 20.13,20.83 CH.A
V3
  Top 0.203: 16.26,10.16 16.26,10.67 15.62,10.67
  Top 0.305: U2.5 21.27,10.61 20.45,11.43 17.02,11.43 16.26,10.67 C2.2
VCC  (via drill 0.3 pad 0.64, 0.89 pad 1.65, 3 pad 5.08)
  Top 0.203: U1.4
  Top 0.305: U1.18 24.79,18.27 26.54,16.51 R4.1 30.99,16.38 | U1.6 25.27,24.08 25.27,25.15 25.53,25.4 v25.91,25.4 26.29,25.02 U1.4 | 38.48,46.41 SW1.COM2 | v11.3,43.81 11.3,44.07 | 3.68,46.1 v3.56,46.23
  Top 0.559: v35.56,27.81 35.56,36.96 Q1.3 37.59,45.59 SW1.COM2 | R4.1 31.11,14.86 31.88,14.1 35.94,14.1 C4.2 43.18,11.68 46.1,8.76 v46.1,7.87 | 11.3,44.07 9.27,46.1 3.68,46.1
  Top 0.813: SW1.COM1 SW1.COM2
  Bottom 0.305: 28.96,25.4 28.96,25.27 29.59,24.64
  Bottom 0.406: v8,21.59 7.87,21.59 7.11,22.35 7.11,42.67 v3.56,46.23
  Bottom 0.559: v11.3,43.81 11.3,38.86 14.86,35.31 14.86,31.88 21.34,25.4 v25.91,25.4 28.96,25.4 29.59,25.4 | R4.1 31.11,18.29 29.59,19.81 29.59,24.64 29.59,25.4 | v35.56,27.81 33.78,26.04 30.23,26.04 29.59,25.4
XTAL1
  Top 0.203: 29.08,28.7 28.83,28.45 28.7,28.45 28.96,28.19 | 29.53,28.89 30.04,28.89 30.04,28.32
  Top 0.305: U1.7 24.79,26.18 27.05,28.45 28.7,28.45 29.34,28.45 X1.2 30.04,28.89 30.73,29.59 C6.2
XTAL2
  Top 0.203: 24.38,28.83 24.64,29.08 24.89,28.83
  Top 0.305: U1.8 24.29,28.04 24.36,28.04 X1.1 24.64,29.08 24.64,29.34 24.13,29.84 C5.2
(copper drawn outside any net)
  shapes: Bottom area x2

### Text on the board
tPlace: GND | - | + | CHARGE STATE | GND
bPlace: 8 SQUARE | V1.1 2014/4/19
tNames: VCC | ON | OFF | 1 | D5 | A4 | VCC | 12 | 13 | A1 | A2 | A3
bNames: http://loovee.github.io/Square8/